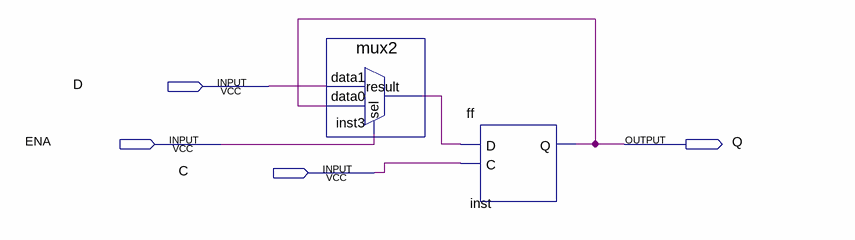
[diagram p0: schematic sheet]
// Quartus schematic ff_en.bdf as structural Verilog: 2 symbols, 4 pins
module ff_en (
  input  D,
  input  ENA,
  input  C,
  output Q
);

  wire inst3_result;

  mux2 inst3 (.data1(D), .data0(Q), .sel(ENA), .result(inst3_result));
  ff inst (.D(inst3_result), .C(C), .Q(Q));
endmodule
